# EAGLE design Helmet_Drop_V2.1 (EAGLE 9.6.2)
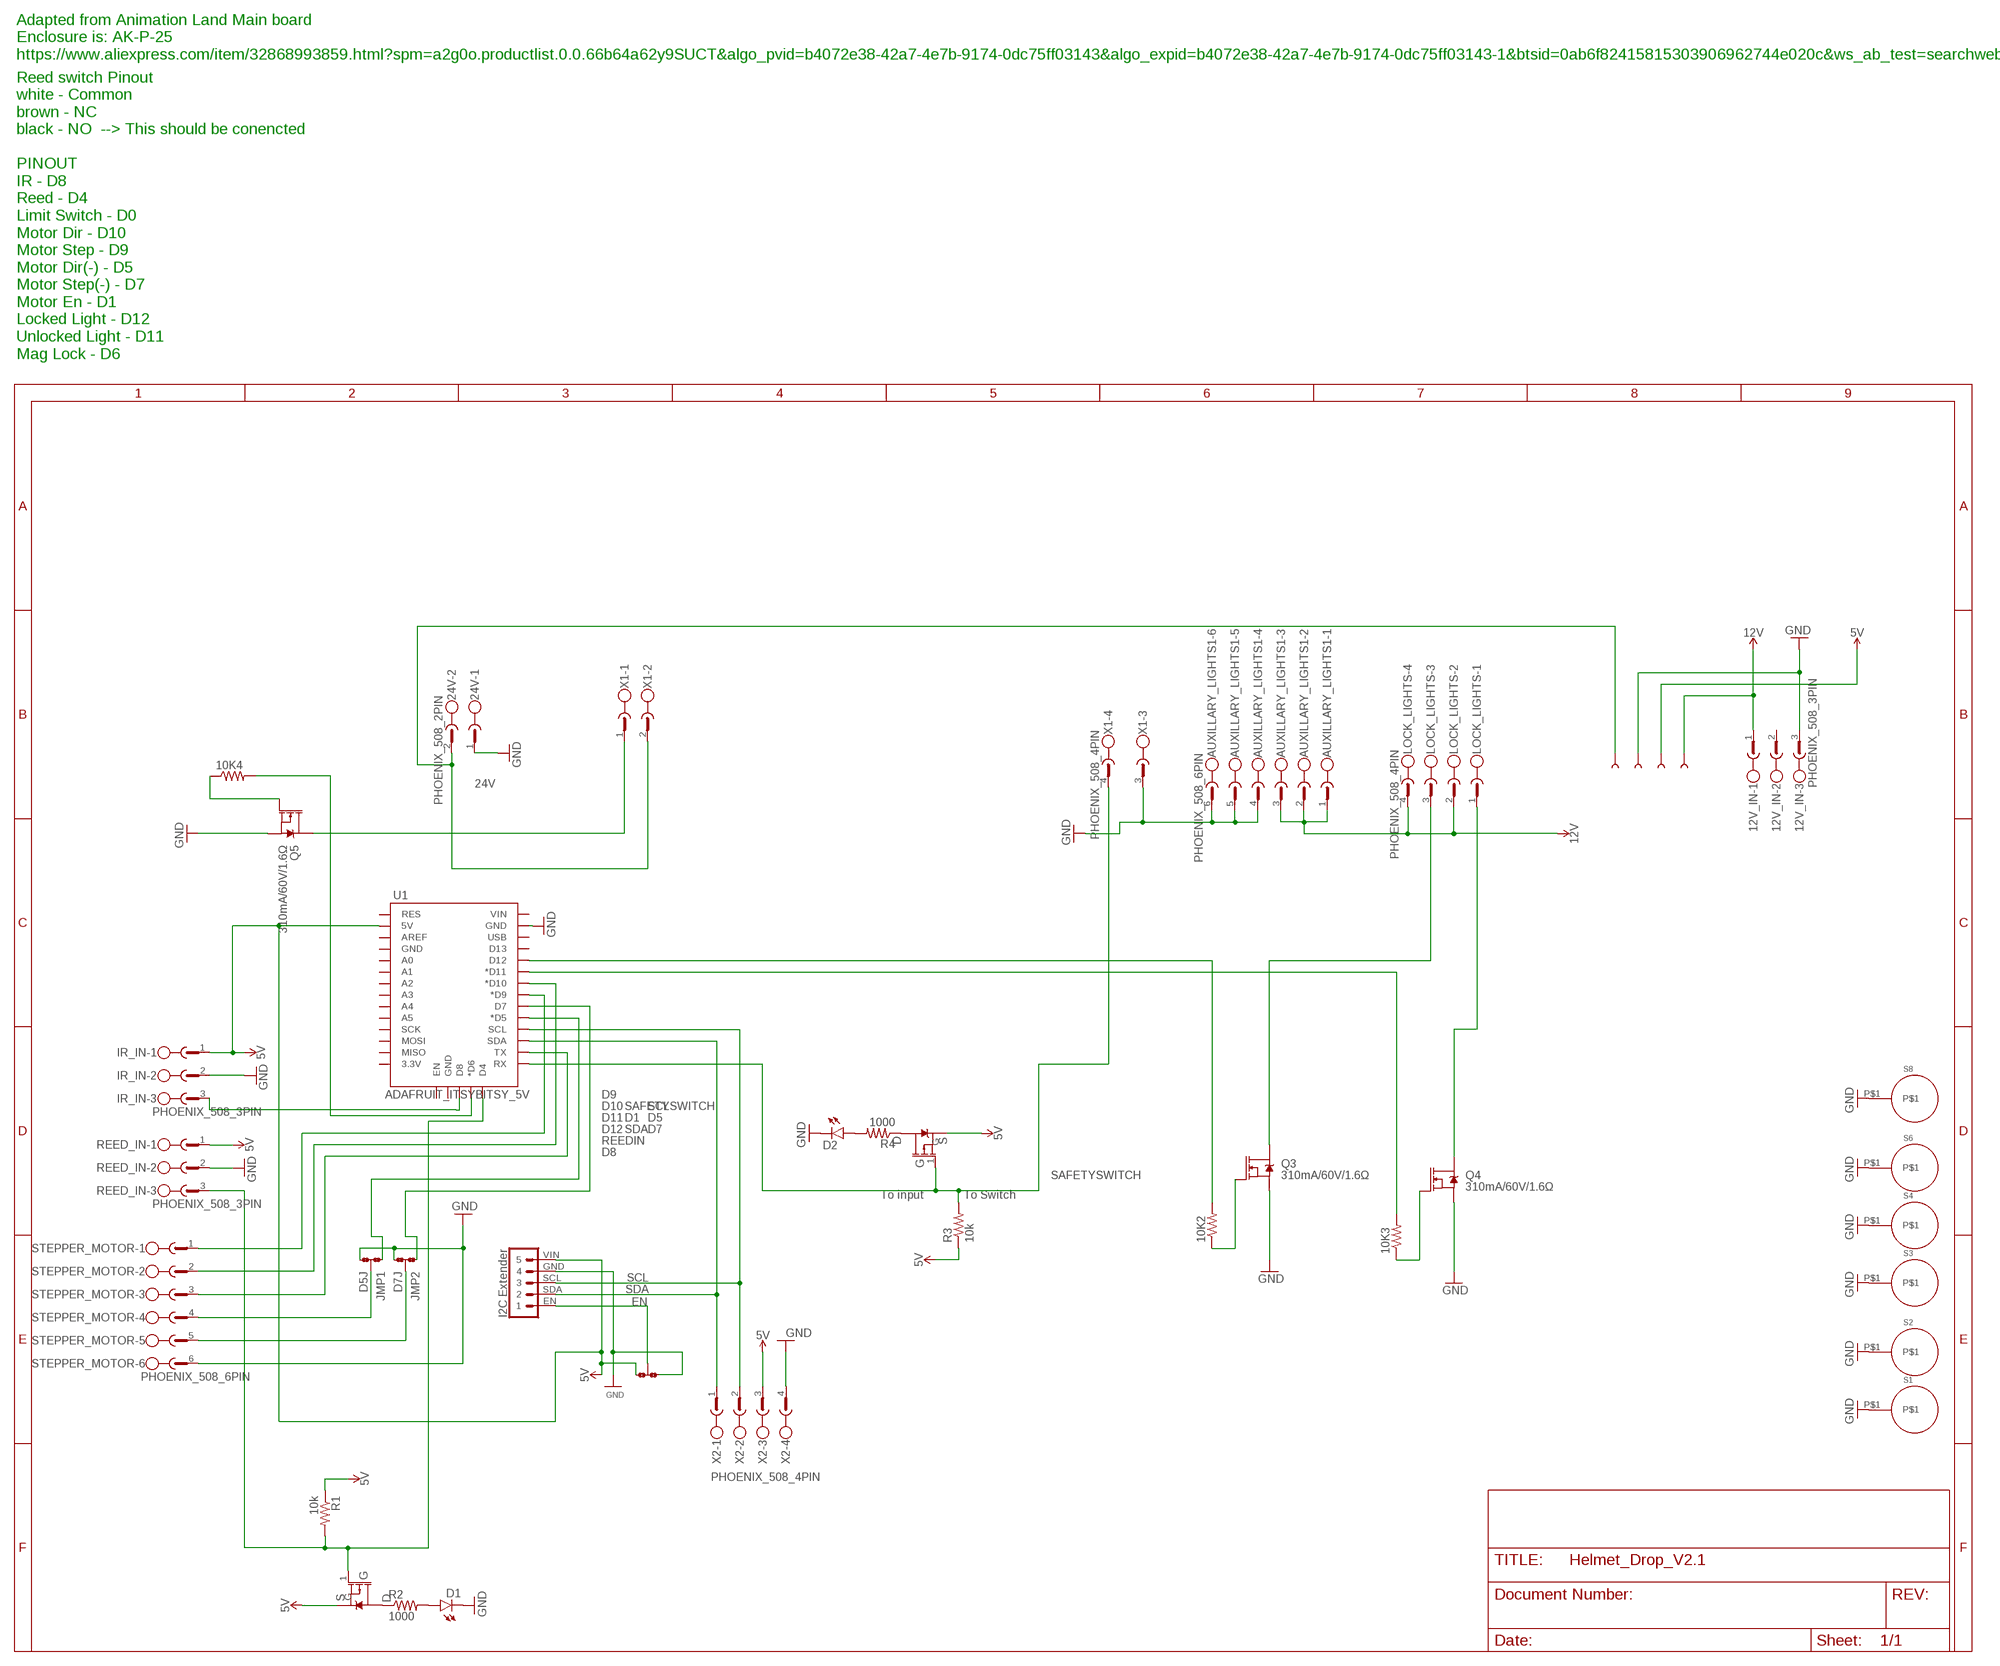
[diagram p0: schematic, sheet 1, part 1 of 2]
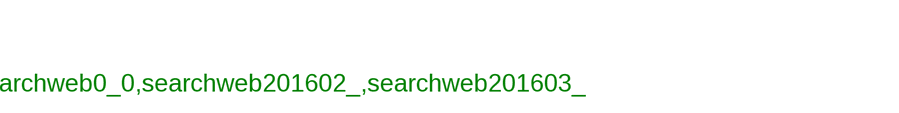
[diagram p1: schematic, sheet 1, part 2 of 2]

## Parts
10K2  RESISTORS0805-RES  [SMD_RESISTOR_0805]
10K3  RESISTORS0805-RES  [SMD_RESISTOR_0805]
10K4  RESISTORS0805-RES  [SMD_RESISTOR_0805]
12V_IN  PHOENIX_508_3PIN  [PHOENIX_508_3PIN]
24V  PHOENIX_508_2PIN  [PHOENIX_508_2PIN]
AUXILLARY_LIGHTS1  PHOENIX_508_6PIN  [PHOENIX_508_6PIN]
D1  GENERIC_LED1206  [SMD_LED-1206]
D2  GENERIC_LED1206  [SMD_LED-1206]
IR_IN  PHOENIX_508_3PIN  [PHOENIX_508_3PIN]
JMP1  SMD_JUMPERA  [JUMPER_A-OR]
JMP2  SMD_JUMPERA  [JUMPER_A-OR]
JMP3  SMD_JUMPERA  [JUMPER_A-OR]
LOCK_LIGHTS  PHOENIX_508_4PIN  [PHOENIX_508_4PIN]
Q1  MOSFET-PCHIRLML9301TRPBF  [SOT23-3]
Q2  MOSFET-PCHIRLML9301TRPBF  [SOT23-3]
Q3  310mA/60V/1.6Ω  MOSFET-NCH  [SO-8_POWER_PAK]
Q4  310mA/60V/1.6Ω  MOSFET-NCH  [SO-8_POWER_PAK]
Q5  310mA/60V/1.6Ω  MOSFET-NCH  [SO-8_POWER_PAK]
R1  10k  RESISTORS0805-RES  [SMD_RESISTOR_0805]
R2  1000  RESISTORS0805-RES  [SMD_RESISTOR_0805]
R3  10k  RESISTORS0805-RES  [SMD_RESISTOR_0805]
R4  1000  RESISTORS0805-RES  [SMD_RESISTOR_0805]
REED_IN  PHOENIX_508_3PIN  [PHOENIX_508_3PIN]
S1  GND_HOLE  [GND_HOLE]
S2  GND_HOLE  [GND_HOLE]
S3  GND_HOLE  [GND_HOLE]
S4  GND_HOLE  [GND_HOLE]
S6  GND_HOLE  [GND_HOLE]
S8  GND_HOLE  [GND_HOLE]
STEPPER_MOTOR  PHOENIX_508_6PIN  [PHOENIX_508_6PIN]
TP1  TEST_POINTTP_15TH_THRU  [TESTPOINT_HEADER_1X01]
TP2  TEST_POINTTP_15TH_THRU  [TESTPOINT_HEADER_1X01]
TP3  TEST_POINTTP_15TH_THRU  [TESTPOINT_HEADER_1X01]
TP4  TEST_POINTTP_15TH_THRU  [TESTPOINT_HEADER_1X01]
U1  ADAFRUIT_ITSYBITSY_5V  [ADAFRUIT_ITSYBITSY]
U$1  I2C_EXTENDER  [I2C_EXTENDER]
X1  PHOENIX_508_4PIN  [PHOENIX_508_4PIN]
X2  PHOENIX_508_4PIN  [PHOENIX_508_4PIN]

## Nets
5V [highpower]: IR_IN.1 JMP3.1 Q1.2(S) Q2.2(S) R1.1 R3.1 REED_IN.1 TP3.P$1 U1.5V U$1.VIN X2.3
12V [highpower]: 12V_IN.1 AUXILLARY_LIGHTS1.1 AUXILLARY_LIGHTS1.2 AUXILLARY_LIGHTS1.3 LOCK_LIGHTS.2 LOCK_LIGHTS.4 TP4.P$1
24V [highpower]: 24V.2 TP1.P$1 X1.2
D1 [Low Power]: STEPPER_MOTOR.3 U1.TX
D5 [Low Power]: JMP1.1 U1.D5(*D5)
D5J [Low Power]: JMP1.2 STEPPER_MOTOR.4
D7 [Low Power]: JMP2.1 U1.D7
D7J [Low Power]: JMP2.2 STEPPER_MOTOR.5
D8 [Low Power]: IR_IN.3 U1.D8
D9 [Low Power]: STEPPER_MOTOR.1 U1.D9(*D9)
D10 [Low Power]: STEPPER_MOTOR.2 U1.D10(*D10)
D11 [Low Power]: 10K3.2 U1.D11(*D11)
D12 [Low Power]: 10K2.2 U1.D12
EN [Low Power]: JMP3.2 U$1.EN
GND [highpower]: 12V_IN.3 24V.1 AUXILLARY_LIGHTS1.4 AUXILLARY_LIGHTS1.5 AUXILLARY_LIGHTS1.6 D1.C D2.C IR_IN.2 JMP1.3 JMP2.3 JMP3.3 Q3.S Q4.S Q5.S REED_IN.2 S1.P$1 S2.P$1 S3.P$1 S4.P$1 S6.P$1 S8.P$1 STEPPER_MOTOR.6 TP2.P$1 U1.GND@2(GND) U$1.GND X1.3 X2.4
N$1 [Low Power]: 10K4.2 U1.D6(*D6)
N$3: Q1.3(D) R4.1
N$4: D2.A R4.2
N$5: Q2.3(D) R2.1
N$6: D1.A R2.2
N$7 [Low Power]: LOCK_LIGHTS.3 Q3.D1(D)
N$10 [Low Power]: LOCK_LIGHTS.1 Q4.D1(D)
N$12 [Low Power]: 10K2.1 Q3.G
N$21 [Low Power]: Q5.D1(D) X1.1
N$27 [Low Power]: 10K3.1 Q4.G
N$28 [Low Power]: 10K4.1 Q5.G
REEDIN: Q2.1(G) R1.2 REED_IN.3 U1.D4
SAFETYSWITCH: Q1.1(G) R3.2 U1.RX X1.4
SCL [Low Power]: U1.SCL U$1.SCL X2.2
SDA [Low Power]: U1.SDA U$1.SDA X2.1
Unconnected: 12V_IN.2 U1.3V(3.3V) U1.A0 U1.A1 U1.A2 U1.A3 U1.A4 U1.A5 U1.AREF U1.D13 U1.EN U1.GND@0(GND) U1.GND@1(GND) U1.MISO U1.MOSI U1.RES U1.SCK U1.USB U1.VIN

## Notes on the sheet
- Adapted from Animation Land Main board
  Enclosure is: AK-P-25
  https://www.aliexpress.com/item/32868993859.html?spm=a2g0o.productlist.0.0.66b64a62y9SUCT&algo_pvid=b4072e38-42a7-4e7b-9174-0dc75ff03143&algo_expid=b4072e38-42a7-4e7b-9174-0dc75ff03143-1&btsid=0ab6f82415815303906962744e020c&ws_ab_test=searchweb0_0,searchweb201602_,searchweb201603_
- Reed switch Pinout
  white - Common
  brown - NC
  black - NO  --> This should be conencted
  
  PINOUT
  IR - D8
  Reed - D4
  Limit Switch - D0
  Motor Dir - D10
  Motor Step - D9
  Motor Dir(-) - D5
  Motor Step(-) - D7
  Motor En - D1
  Locked Light - D12
  Unlocked Light - D11
  Mag Lock - D6
- To input | To Switch

## Library data of the parts
10K2-10K4 R1-R4 = OMSI_Default_V1:RESISTORS: Resistor Basic schematic elements and footprints for 0603, 1206, and PTH resistors.
12V_IN IR_IN REED_IN = OMSI_Default_V1:PHOENIX_508_3PIN: PHOENIX; MF: FARNELL; MPN: 1757255; OC_FARNELL: 3705183; OC_NEWARK: 71C4162
24V = OMSI_Default_V1:PHOENIX_508_2PIN: PHOENIX; MF: FARNELL; MPN: 1757242; OC_FARNELL: 3705171; OC_NEWARK: 71C4161
AUXILLARY_LIGHTS1 STEPPER_MOTOR = OMSI_Default_V1:PHOENIX_508_6PIN: PHOENIX; MF: FARNELL; MPN: 1757284; OC_FARNELL: 3705213; OC_NEWARK: 71C4165
D1 D2 = OMSI_Default_V1:GENERIC_LED: LED (Generic) Standard schematic elements and footprints for 5mm, 3mm, 1206, and 0603 sized LEDs. Generic LEDs with no color specified.
JMP1-JMP3 = OMSI_Default_V1:SMD_JUMPER: SMD 0R 0805 Jumper
LOCK_LIGHTS X1 X2 = OMSI_Default_V1:PHOENIX_508_4PIN: PHOENIX; MF: FARNELL; MPN: 1757268; OC_FARNELL: 3705195; OC_NEWARK: 71C4163
Q1 Q2 = OMSI_Default_V1:MOSFET-PCH: MOSFET-PCH; DESCRIPTION: 30V 3.6A SOT-23-3 3.3v drv capable
Q3-Q5 = OMSI_Default_V1:MOSFET-NCH: N-channel MOSFETs from Sparkfun-DiscreteSemi Library; PROD_ID: TRANS-11151
S1-S4 S6 S8 = OMSI_Default_V1:GND_HOLE
TP1-TP4 = OMSI_Default_V1:TEST_POINT: SparkFun Test Points Bare copper test points for troubleshooting or In-Circuit-Testing. These are used by our Production team for verifying production board runs using pogo-pins on test beds. SparkFun Products: SparkFun LSM9DS1 Breakout <https://www.sparkfun.com/products/13284> SparkFun PSOC <https://www.sparkfun.com/products/13714> SparkFun Load Cell Amplifier <https://www.sparkfun.com/products/13879>
U1 = OMSI_Default_V1:ADAFRUIT_ITSYBITSY_5V: Adafruit ItsyBitsy 32u4 - 5V 16MHz https://www.adafruit.com/product/3677
U$1 = OMSI_Default_V1:I2C_EXTENDER

## Net classes
1 highpower: width 0.635 mm, drill 0.483 mm, clearance 0.127 mm
2 Low Power: width 0.254 mm, drill 0.483 mm

## Board
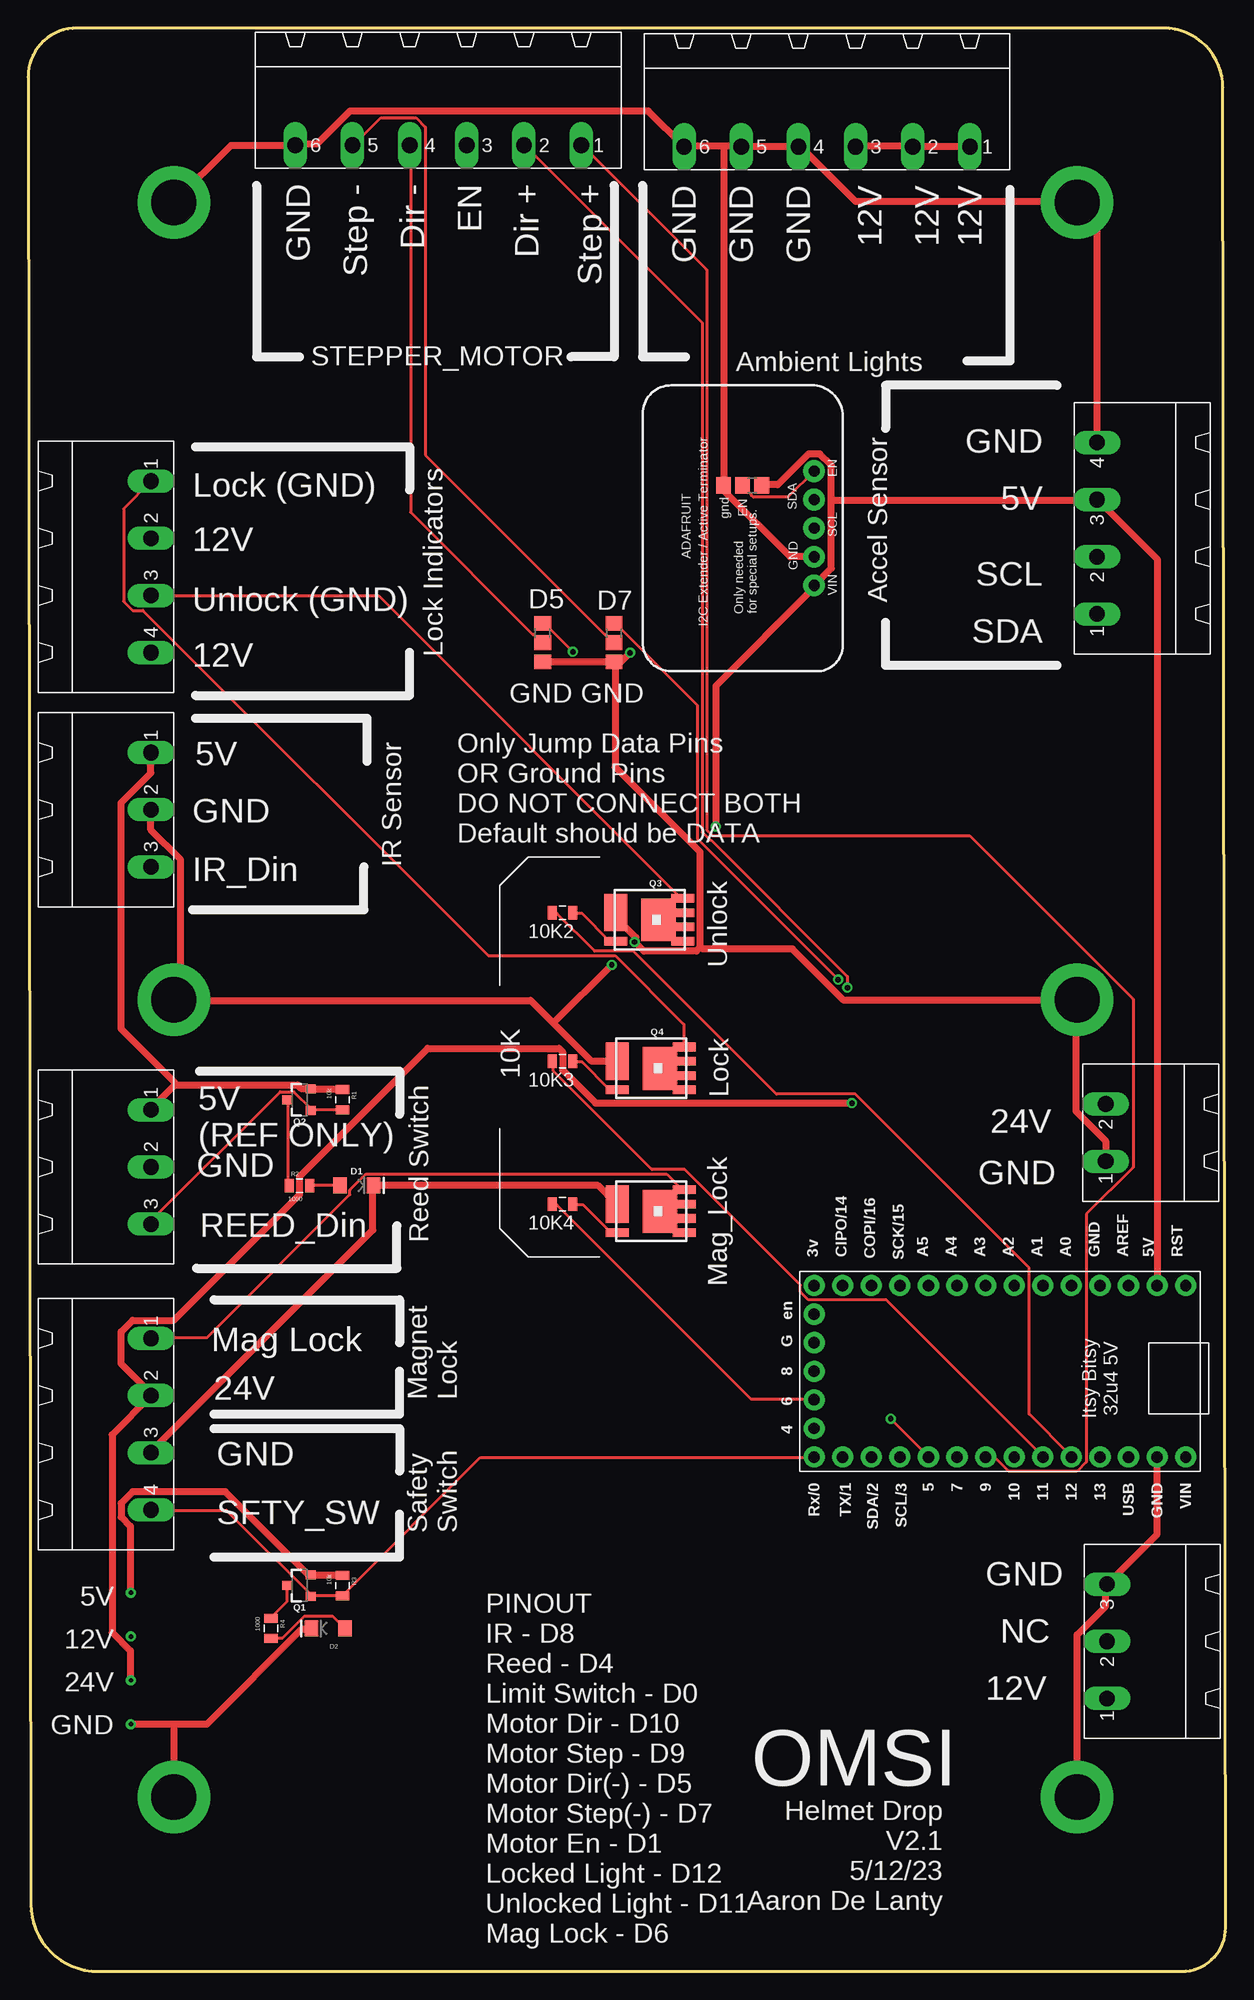
[diagram p2: board, top side]
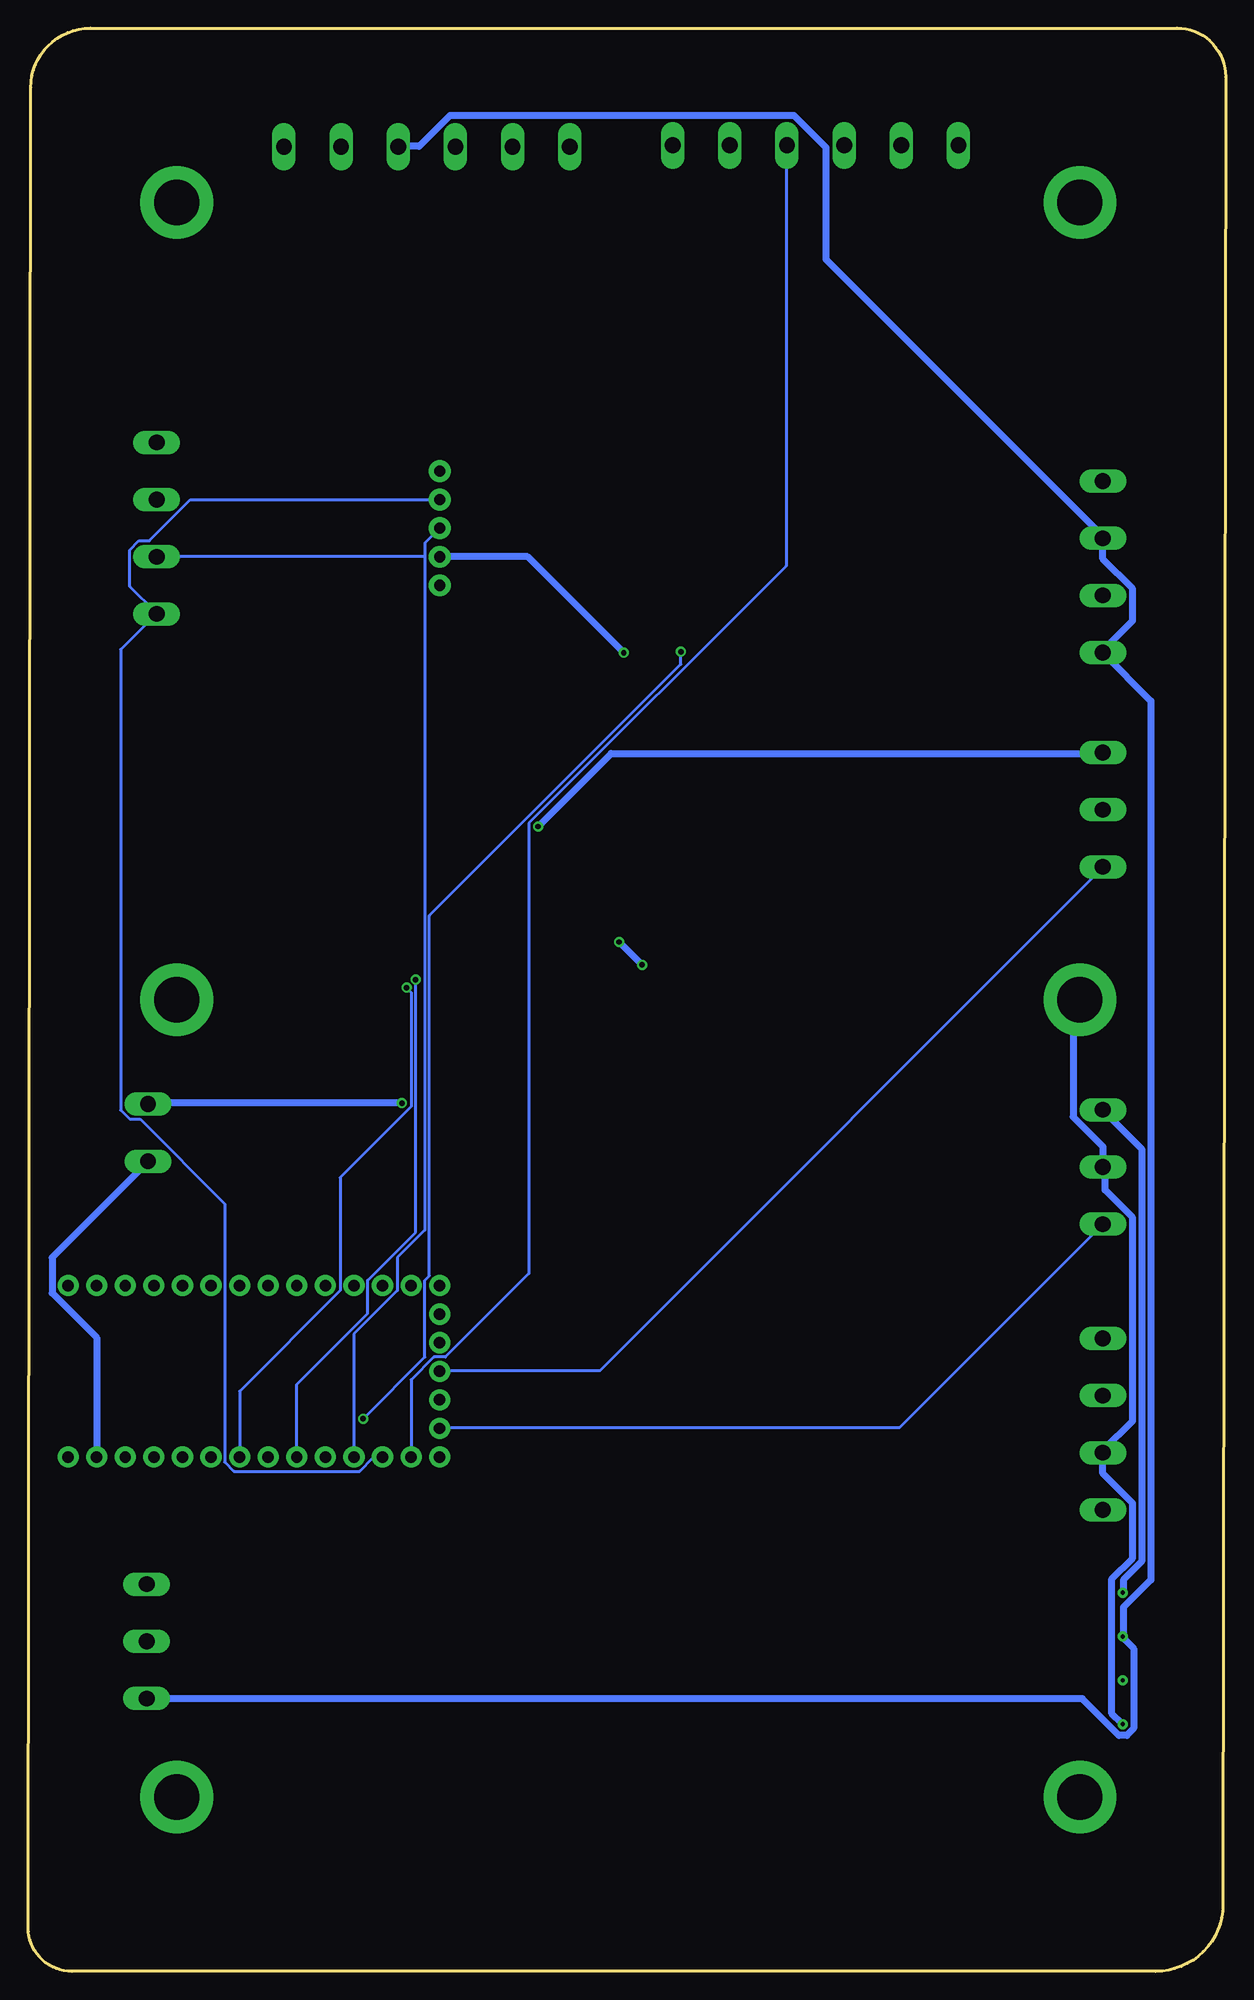
[diagram p3: board, bottom side, seen from below]

Size 106.41 x 172.72 mm. Coordinates in mm from the lower left corner, seen from the top.
Outline: 106.41,3.89 106.17,167.44 arc90 100.89,172.72 4.33,172.72 arc90 0,168.39 0.24,5.97 arc90 6.22,0 102.53,0 arc90 106.41,3.89
Copper layers (1*16): Top 0.035mm / dielectric 1.5mm / Bottom 0.035mm
Design rules "default *": minimum track width 10mil, minimum drill 0.35mm, track to track 6mil, track to pad 6mil, pad to pad 6mil, via to via 6mil, smd to smd 6mil, copper to edge 40mil, drill to drill 6mil, minimum pad ring 10mil, minimum via ring 8mil, stop-mask expansion 4mil, vias tented up to drill 0mil, thermal gap 10mil

### Footprints (pad centres in the part's own frame; a part is rotated, then mirrored left to right if it is on the bottom)
SMD_RESISTOR_0805 = smd 0.8 x 1.2: 1 -0.9,0; 2 0.9,0
PHOENIX_508_3PIN = drill 1.397 long: 1 -5.08,5.08; 2 0,5.08; 3 5.08,5.08
PHOENIX_508_2PIN = drill 1.397 long: 1 -2.54,5.08; 2 2.54,5.08
PHOENIX_508_6PIN = drill 1.397 long: 1 -12.7,5.08; 2 -7.62,5.08; 3 -2.54,5.08; 4 2.54,5.08; 5 7.62,5.08; 6 12.7,5.08
SMD_LED-1206 = smd 1.2 x 1.4: A -1.5,0; C 1.5,0
JUMPER_A-OR = smd 1.5 x 1.3: 1 0,1.7; 2 0,0; 3 0,-1.7
PHOENIX_508_4PIN = drill 1.397 long: 1 -7.62,5.08; 2 -2.54,5.08; 3 2.54,5.08; 4 7.62,5.08
SOT23-3 = smd 0.8 x 0.9: 1 -0.95,-1; 2 0.95,-1; 3 0,1.1
SO-8_POWER_PAK = smd 0.762 x 2.032: D1 -3.423,2.437; D2 -2.153,2.437; D3 -0.883,2.437; D4 0.387,2.437; G 0.387,-3.532 | smd 3.81 x 3.048: D5 -1.518,0.278 | smd 3.302 x 2.032: S -2.153,-3.532
GND_HOLE = drill 4 pad 6.452: P$1 0,0
TESTPOINT_HEADER_1X01 = drill 0.381 pad 0.61: P$1 0,0
ADAFRUIT_ITSYBITSY = drill 1.016 pad 1.88: 3V -7.62,-16.51; 5V -7.62,13.97; A0 -7.62,6.35; A1 -7.62,3.81; A2 -7.62,1.27; A3 -7.62,-1.27; A4 -7.62,-3.81; A5 -7.62,-6.35; AREF -7.62,11.43; D4 5.08,-16.51; D5 7.62,-6.35; D6 2.54,-16.51; D7 7.62,-3.81; D8 0,-16.51; D9 7.62,-1.27; D10 7.62,1.27; D11 7.62,3.81; D12 7.62,6.35; D13 7.62,8.89; EN -5.08,-16.51; GND@0 -7.62,8.89; GND@1 -2.54,-16.51; GND@2 7.62,13.97; MISO -7.62,-13.97; MOSI -7.62,-11.43; RES -7.62,16.51; RX 7.62,-16.51; SCK -7.62,-8.89; SCL 7.62,-8.89; SDA 7.62,-11.43; TX 7.62,-13.97; USB 7.62,11.43; VIN 7.62,16.51
I2C_EXTENDER = drill 1 pad 1.93: EN 17.78,2.54; GND 10.16,2.54; SCL 12.7,2.54; SDA 15.24,2.54; VIN 7.62,2.54

### Placement (x,y rotation side)
10K2  47.49,94.11 180 top
10K3  47.49,80.9 180 top
10K4  47.49,68.2 180 top
12V_IN  100.96,29.34 90 top
24V  100.83,74.55 90 top
AUXILLARY_LIGHTS1  70.99,167.26 180 top
D1  29.2,69.85 0 top
D2  26.66,30.48 180 top
IR_IN  5.84,103.25 270 top
JMP1  45.71,118.11 0 top
JMP2  52.06,118.11 0 top
JMP3  63.49,132.08 270 top
LOCK_LIGHTS  5.84,124.84 270 top
Q1  24.12,34.29 90 top
Q2  24.12,77.47 90 top
Q3  55.75,91.95 270 top
Q4  55.87,78.74 270 top
Q5  55.87,66.04 270 top
R1  27.93,77.47 270 top
R2  24.12,69.85 0 top
R3  27.93,34.29 270 top
R4  21.58,30.48 270 top
REED_IN  5.84,71.5 270 top
S1  12.95,15.49 0 top
S2  93.21,15.49 0 top
S3  93.21,86.36 0 top
S4  93.21,157.23 0 top
S6  12.95,86.36 0 top
S8  12.95,157.23 0 top
STEPPER_MOTOR  36.44,167.39 180 top
TP1  9.14,25.87 0 top
TP2  9.14,21.97 0 top
TP3  9.14,33.65 0 top
TP4  9.14,29.76 0 top
U1  86.35,53.34 270 top
U$1  72.38,115.57 90 top
X1  5.84,48.64 270 top
X2  100.07,128.27 90 top

### Tracks (layer width: path | path; a pad name or v marks a point on that pad's centre or on a via)
5V  (via drill 0.48)
  Top 0.635: R3.1 27.88,35.2 25.14,35.2 Q1.2 24.83,35.31 17.52,42.62 9.29,42.62 8.27,41.6 8.27,40.39 9.09,39.57 9.09,33.68 TP3.P$1 | R1.1 27.88,78.38 25.14,78.38 Q2.2 24.83,78.49 24.23,78.49 23.92,78.79 13.05,78.79 | 13.05,78.79 10.92,76.66 REED_IN.1 | IR_IN.1 10.92,106.53 8.27,103.89 8.27,83.77 12.95,79.1 13.05,78.79 | 71.37,130.71 71.37,124.71 U$1.VIN 69.74,122.89 61.11,114.25 v61.11,101.75 | 71.37,130.71 71.37,133.86 70.35,134.87 69.34,134.87 66.59,132.13 65.27,132.13 JMP3.1 | U1.5V 100.32,125.53 95.04,130.81 X2.3 94.74,130.71 71.37,130.71
  Bottom 0.635: TP3.P$1 9.09,33.68 9.09,34.8 7.46,36.42 7.46,73.1 10.92,76.56 REED_IN.1 | v61.11,101.75 54.6,108.26 10.92,108.26 IR_IN.1
12V
  Top 0.635: AUXILLARY_LIGHTS1.3 73.6,162.2 78.58,162.2 AUXILLARY_LIGHTS1.2 78.89,162.2 83.66,162.2 AUXILLARY_LIGHTS1.1
  Bottom 0.635: 12V_IN.1 95.85,24.23 12.74,24.23 9.49,20.98 8.78,20.98 8.17,21.59 8.17,28.7 8.99,29.52 TP4.P$1 9.09,29.82 9.09,32.36 6.65,34.8 6.65,112.93 10.92,117.2 LOCK_LIGHTS.4 10.81,117.5 8.27,120.04 8.27,122.89 10.92,125.53 LOCK_LIGHTS.2 11.02,127.66 35.5,152.15 35.5,162.1 38.35,164.95 68.93,164.95 71.67,162.2 73.5,162.2 AUXILLARY_LIGHTS1.3
24V  (via drill 0.48)
  Top 0.635: TP1.P$1 9.09,25.96 9.09,28.5 7.46,30.12 7.46,47.7 10.92,51.16 X1.2 10.81,51.46 8.27,54 8.27,56.84 9.29,57.86 12.95,57.86 24.12,69.04 24.12,70.66 35.5,82.04 47.19,82.04 47.49,81.74 47.49,80.11 50.44,77.17 v73.2,77.17
  Bottom 0.635: v73.2,77.17 95.75,77.17 24V.2
D1
  Bottom 0.254: U1.TX 72.38,52.58 70.35,54.61 69.34,54.61 61.92,62.03 61.92,102.06 39.06,124.92 39.06,162.31 STEPPER_MOTOR.3
D5  (via drill 0.48)
  Top 0.254: v48.41,117.3 45.97,119.74 45.76,119.74 JMP1.1 | v76.65,49.12 80,45.77 U1.D5
  Bottom 0.254: v48.41,117.3 48.41,116.18 70.76,93.83 70.76,61.82 71.16,61.42 71.16,54.61 v76.65,49.12
D5J
  Top 0.254: JMP1.2 45.66,118.11 44.95,118.82 44.85,118.82 33.98,129.69 33.98,162.31 STEPPER_MOTOR.4
D7  (via drill 0.48)
  Top 0.254: v71.98,88.14 59.48,100.64 59.48,112.52 52.27,119.74 52.06,119.74 JMP2.1
  Bottom 0.254: v71.98,88.14 71.98,65.68 76.24,61.42 76.24,58.47 82.54,52.17 U1.D7
D7J
  Top 0.254: JMP2.2 51.35,118.82 51.25,118.82 35.3,134.77 35.3,163.93 34.49,164.74 31.34,164.74 28.9,162.31 STEPPER_MOTOR.5
D8
  Bottom 0.254: U1.D8 69.84,53.39 55.62,53.39 10.92,98.09 IR_IN.3
D9
  Top 0.254: U1.D9 85.08,45.67 85.9,45.67 87.12,44.45 93.21,44.45 94.02,45.26 94.02,67.31 98.19,71.48 98.19,86.41 83.66,100.94 60.8,100.94 60.29,101.45 60.29,151.23 49.22,162.31 STEPPER_MOTOR.1
D10  (via drill 0.48)
  Top 0.254: v72.79,87.43 72.79,88.44 60.7,100.53 60.6,100.53 59.89,101.24 59.89,146.56 44.14,162.31 STEPPER_MOTOR.2
  Bottom 0.254: U1.D10 87.62,51.56 78.68,60.5 78.68,70.56 72.38,76.86 72.38,87.02 v72.79,87.43
D11
  Top 0.254: 10K3.2 46.68,80.82 46.68,80.01 55.42,71.27 58.36,71.27 68.62,61.01 68.62,60.4 69.34,59.69 76.24,59.69 90.16,45.77 U1.D11
D12
  Top 0.254: 10K2.2 46.68,94.03 46.98,94.03 50.34,90.68 53.79,90.68 66.49,77.98 73.5,77.98 88.94,62.53 88.94,49.53 92.7,45.77 U1.D12
EN
  Top 0.254: JMP3.2 64.26,131.32 64.26,131.22 64.46,131.01 67.51,131.01 U$1.EN
GND  (via drill 0.48)
  Top 0.635: 46.68,84.28 44.65,86.31 12.95,86.31 S6.P$1 13.56,86.61 13.56,98.81 10.92,101.45 IR_IN.2 | 46.68,84.28 50.03,80.92 52.27,80.92 Q4.S | Q5.S 52.27,68.22 50.64,69.85 D1.C 30.63,69.55 30.63,65.89 10.92,46.18 X1.3 | 12.95,22 9.19,22 TP2.P$1 | 12.95,22 15.89,22 24.33,30.43 25.14,30.43 D2.C | 12.95,22 S1.P$1 | X2.4 94.94,135.89 94.94,155.5 S4.P$1 92.91,157.33 73.5,157.33 68.73,162.1 AUXILLARY_LIGHTS1.4 68.42,162.2 63.65,162.2 AUXILLARY_LIGHTS1.5 63.34,162.2 61.82,162.2 | S8.P$1 18.03,162.31 STEPPER_MOTOR.6 24.02,162.41 25.65,162.41 28.59,165.35 55.11,165.35 AUXILLARY_LIGHTS1.6 58.36,162.2 61.82,162.2 | U$1.GND 67.71,125.73 61.82,131.62 61.82,132.03 JMP3.3 61.82,132.33 61.82,162.2 | U1.GND@2 100.32,38.86 12V_IN.3 95.75,34.19 95.75,32.46 93.21,29.92 S2.P$1 | JMP1.3 45.76,116.38 52.06,116.38 JMP2.3 | 53.99,91.49 53.99,91.39 54.71,90.68 59.38,90.68 59.68,90.98 | 53.99,91.49 53.99,91.9 52.27,93.62 52.27,94.03 Q3.S | 59.68,90.98 59.68,99.52 52.17,107.04 52.17,116.08 JMP2.3 | 24V.1 95.75,73.81 93.11,76.45 93.11,86.21 93.21,86.31 S3.P$1 92.81,86.31 72.49,86.31 67.91,90.88 59.99,90.88 59.68,90.98 | v53.49,117.2 52.47,116.18 JMP2.3 | v51.86,89.46 46.68,84.28 | v53.89,91.49 53.99,91.49
  Bottom 0.635: S6.P$1 12.95,86.31 13.56,85.7 13.56,75.95 10.92,73.3 REED_IN.2 10.71,71.27 10.71,69.44 8.27,67.01 8.27,48.92 10.81,46.38 X1.3 10.92,44.25 8.27,41.6 8.27,36.73 10.1,34.9 10.1,22.91 9.19,22 TP2.P$1 | U1.GND@2 100.32,56.34 104.29,60.3 104.29,63.45 95.75,71.98 24V.1 | U$1.GND 62.02,125.73 v53.49,117.2 | v53.89,91.49 v51.86,89.46
N$1
  Top 0.254: 10K4.2 46.68,68.12 46.98,68.12 64.26,50.85 69.84,50.85 U1.D6
N$3
  Top 0.254: Q1.3 23.01,34.29 23.01,32.87 21.58,31.45 R4.1
N$4
  Top 0.254: R4.2 21.58,29.62 22.6,29.62 24.53,31.55 27.07,31.55 28.09,30.53 D2.A
N$5
  Top 0.254: Q2.3 23.11,77.47 23.11,69.95 23.21,69.85 R2.1
N$6
  Top 0.254: D1.A R2.2
N$7
  Top 0.254: Q3.D1 58.16,95.45 57.96,95.45 31.13,122.28 10.92,122.28 LOCK_LIGHTS.3
N$10
  Top 0.254: Q4.D1 58.26,82.25 58.26,84.18 52.17,90.27 40.89,90.27 10.2,120.95 9.29,120.95 8.48,121.77 8.48,130 10.92,132.44 LOCK_LIGHTS.1
N$12
  Top 0.254: 10K2.1 48.41,94.03 49.22,94.03 51.66,91.59 52.17,91.59 Q3.G
N$21
  Top 0.254: Q5.D1 58.26,69.55 58.06,69.55 56.74,70.87 30.02,70.87 28.59,69.44 28.59,69.04 15.89,56.34 10.92,56.34 X1.1
N$27
  Top 0.254: 10K3.1 48.41,80.82 49.22,80.82 51.66,78.38 52.27,78.38 Q4.G
N$28
  Top 0.254: 10K4.1 48.41,68.12 49.32,68.12 51.76,65.68 52.27,65.68 Q5.G
REEDIN
  Top 0.254: R1.2 27.88,76.56 25.14,76.56 Q2.1 25.14,76.66 23.62,78.18 22.4,78.18 10.92,66.7 REED_IN.3
  Bottom 0.254: U1.D4 69.84,48.31 29,48.31 10.92,66.4 REED_IN.3
SAFETYSWITCH
  Top 0.254: X1.4 10.92,41 17.62,41 25.14,33.48 Q1.1 25.14,33.38 27.88,33.38 R3.2 27.98,33.48 40.18,45.67 69.84,45.67 U1.RX
SCL
  Bottom 0.254: U1.SCL 77.46,56.64 73.6,60.5 73.6,63.45 71.16,65.89 71.16,125.73 | 71.16,125.73 71.16,126.95 U$1.SCL | 71.16,125.73 X2.2
SDA
  Bottom 0.254: U1.SDA 74.92,45.67 75.74,45.67 76.96,44.45 88.13,44.45 88.94,45.26 88.94,68.22 96.46,75.74 97.38,75.74 98.19,76.56 98.19,117.5 95.04,120.65 X2.1 95.04,120.75 97.38,123.09 97.38,126.34 96.56,127.15 95.65,127.15 91.99,130.81 U$1.SDA

### Text on the board
tNames: GND | Step - | Dir - | EN | Dir + | Step + | GND | GND | GND | 12V | 12V | 12V | Ambient Lights | GND | 5V | Lock (GND) | gnd | EN | 12V | SCL | D5 | D7 | Accel Sensor | Unlock (GND) | Only needed / for special setups. | SDA | Lock Indicators | 12V | GND | GND | 5V | GND | Only Jump Data Pins / OR Ground Pins / DO NOT CONNECT BOTH / Default should be DATA | IR Sensor | IR_Din | Unlock | 10K | Lock | 24V | 5V / (REF ONLY) | Mag_Lock | GND | GND | REED_Din | Reed Switch | Mag Lock | 24V | Magnet / Lock | GND | SFTY_SW | Safety / Switch | 5V | GND | 12V | NC | 24V | 12V | GND | OMSI | Helmet Drop / V2.1 / 5/12/23 / Aaron De Lanty | PINOUT / IR - D8 / Reed - D4 / Limit Switch - D0 / Motor Dir - D10 / Motor Step - D9 / Motor Dir(-) - D5 / Motor Step(-) - D7 / Motor En - D1 / Locked Light - D12 / Unlocked Light - D11 / Mag Lock - D6